# EasyEDA schematic aqicluster_easyeda.json
TITLE: Sheet_1; REV: 1.0; Date: 2021-01-19; Sheet: 1/1; Drawn By: elamdf; Company: Your Company
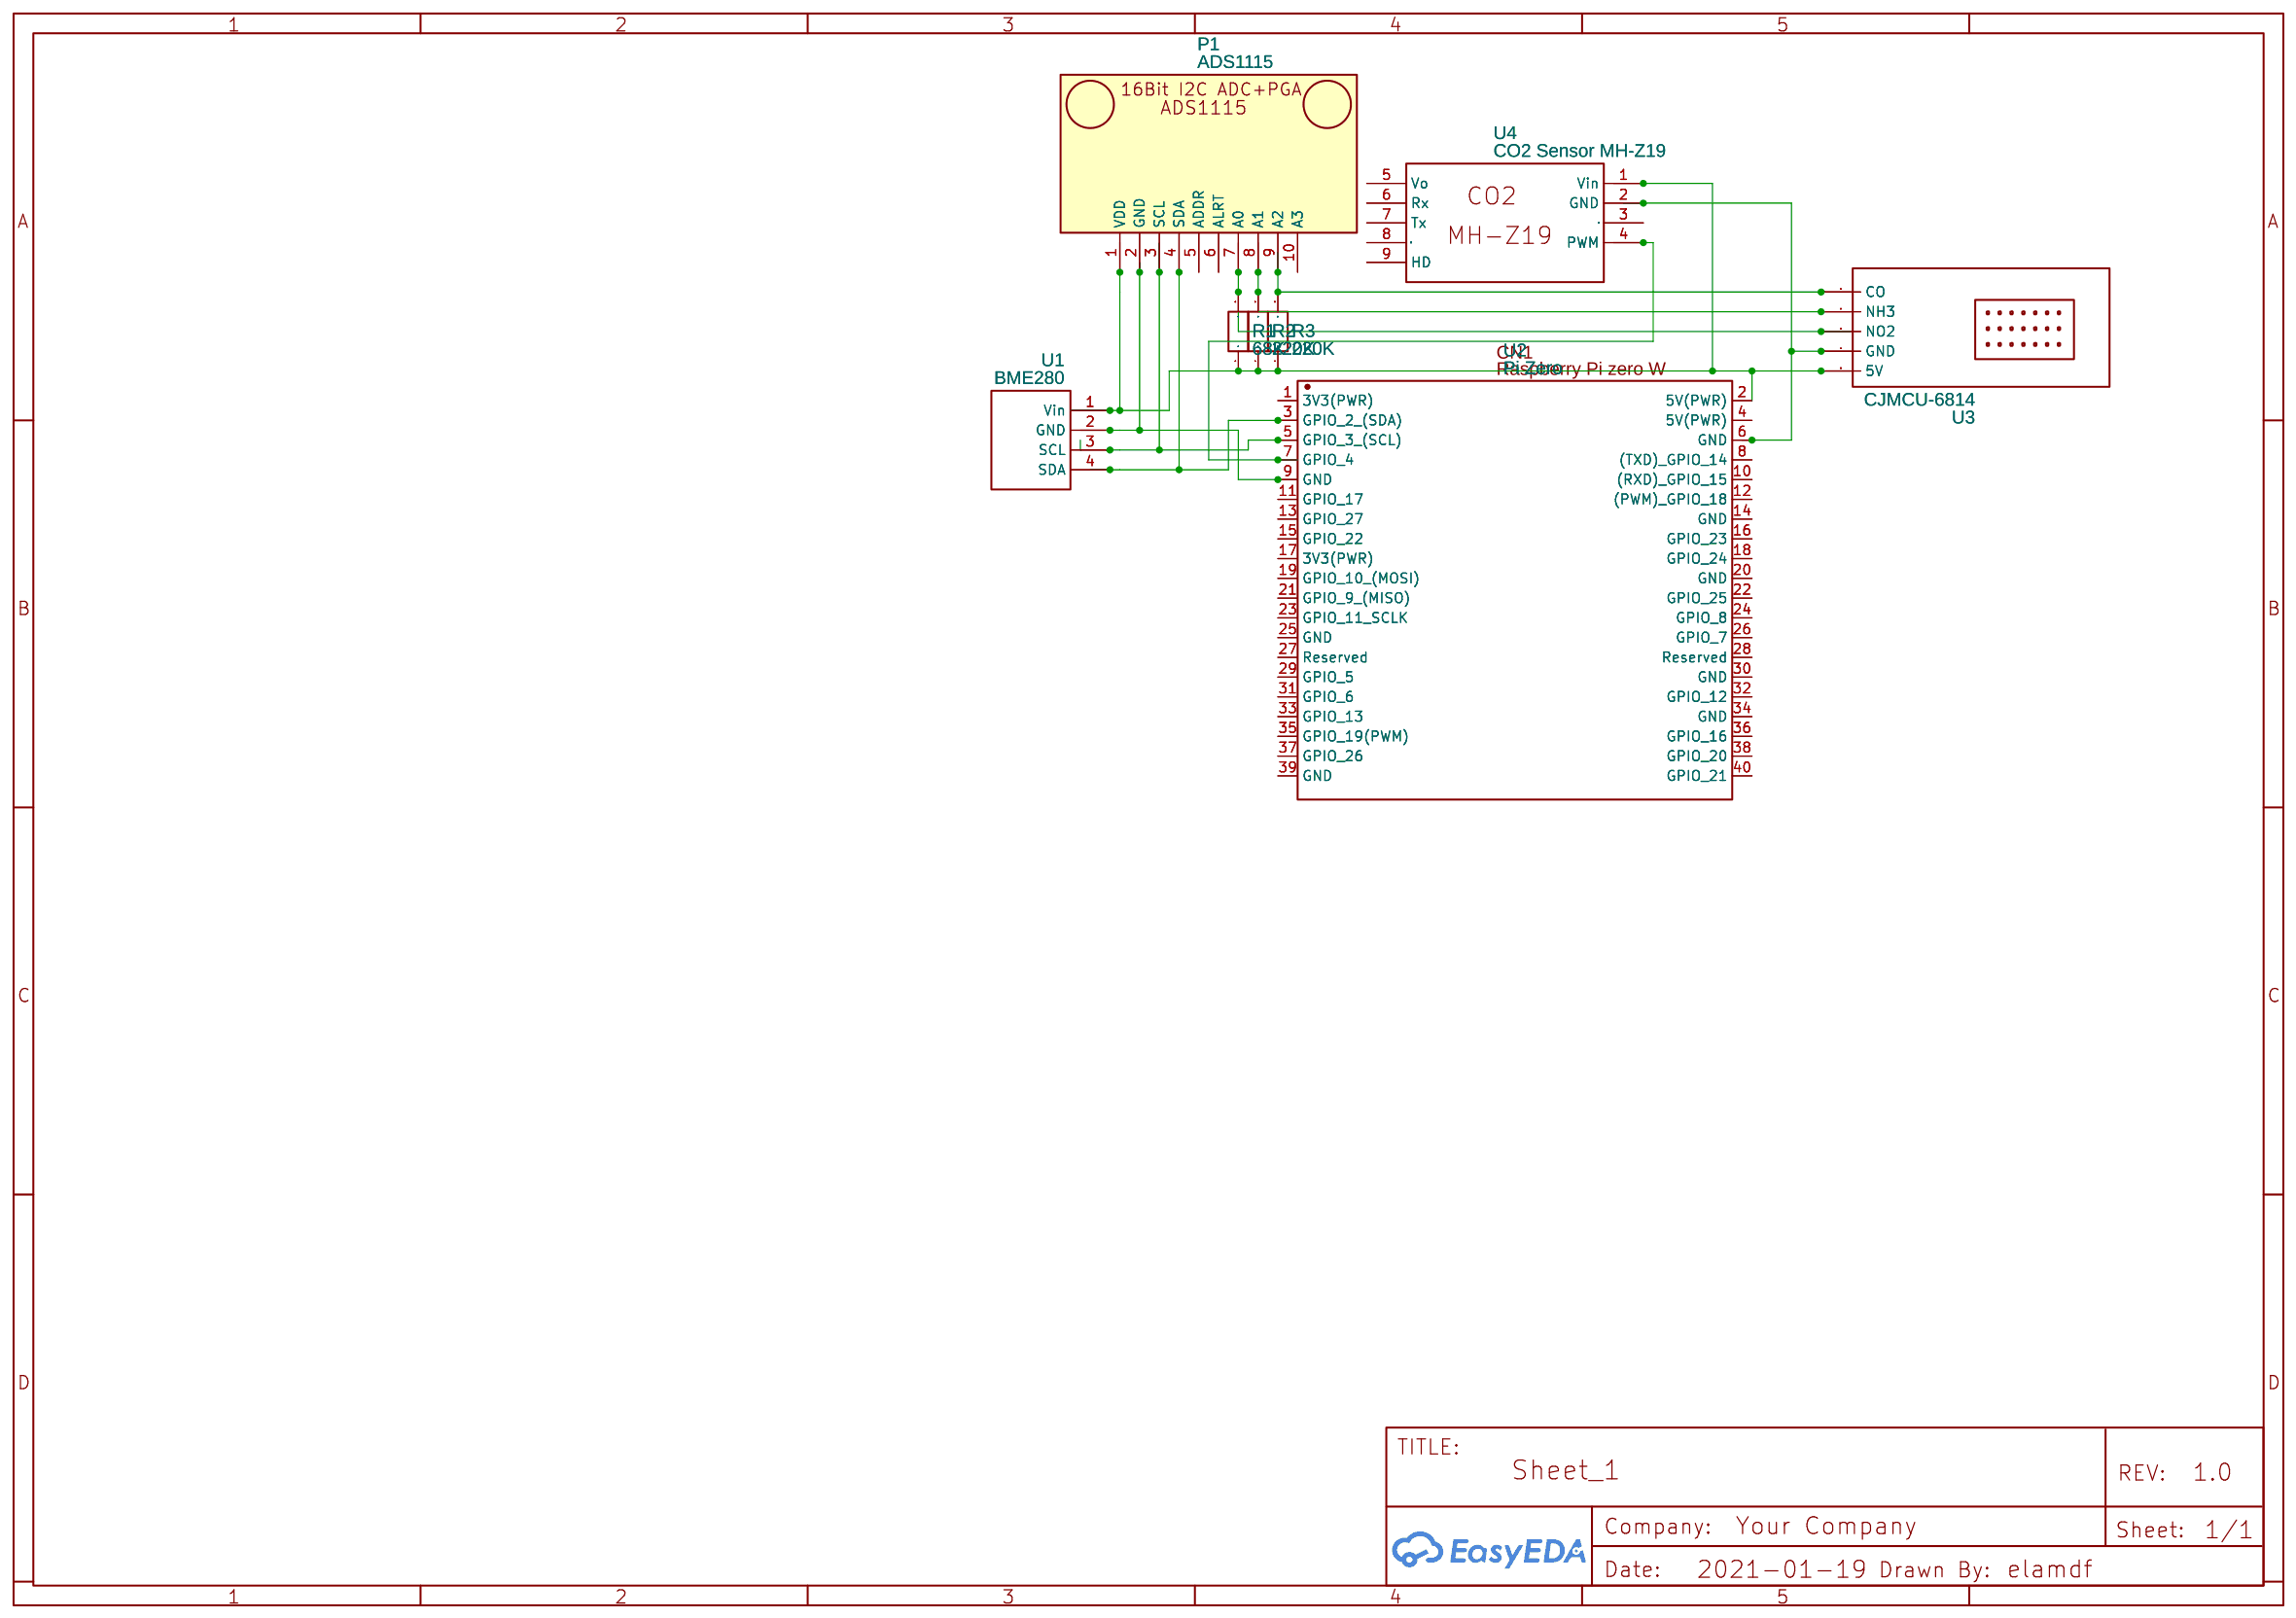
[diagram p0: schematic sheet]

## Parts
P1  ADS1115  [ADS1115 BREAKOUT BOARD NO HOLES]
R1  68K  [1/4 WATT RESISTOR]
R2  220K  [1/4 WATT RESISTOR]
R3  220K  [1/4 WATT RESISTOR]
U1  BME280  [BME280]
U2  Pi Zero  [RASPBERRY_PI_ZERO]
U3  CJMCU-6814  [CJMCUADS1115]
U4  CO2 Sensor MH-Z19  [CO2 SENSOR MH-Z19]

## Library data of the parts
P1 = ADS1115: sourceId: 1T5FDZYC8
R1 = 68K: Contributor: canarywood
R2 R3 = 220K: Contributor: canarywood
U1 = BME280: Contributor: Kuba Jaszczur
U2 = Pi Zero: Contributor: James Stallings
U3 = CJMCU-6814: Manufacturer Part: CJMCU; Contributor: kacperpaciorkowski123; Supplier Part: https://pt.aliexpress.com/item/32762216430.html; Supplier: banggood
U4 = CO2 Sensor MH-Z19: Contributor: allvex

## Nets
Net-(P1-1): P1.1(VDD) R1.1 R2.1 R3.1 U1.1(Vin) U2.2(5V(PWR)) U3.5(5V) U4.1(Vin)
Net-(P1-2): P1.2(GND) U1.2(GND) U2.9(GND)
Net-(P1-3): P1.3(SCL) U1.3(SCL) U2.5(GPIO 3 (SCL))
Net-(P1-4): P1.4(SDA) U1.4(SDA) U2.3(GPIO 2 (SDA))
Net-(P1-7): P1.7(A0) R1.2 U3.3(NO2)
Net-(P1-8): P1.8(A1) R2.2 U3.2(NH3)
Net-(P1-9): P1.9(A2) R3.2 U3.1(CO)
Net-(U2-6): U2.6(GND) U3.4(GND) U4.2(GND)
Net-(U2-7): U2.7(GPIO 4) U4.4(PWM)

Not connected (* = marked no-connect by the designer): P1 5(ADDR) 6(ALRT) 10(A3); U2 1(3V3(PWR)) 4(5V(PWR)) 8((TXD) GPIO 14) 10((RXD) GPIO 15) 11(GPIO 17) 12((PWM) GPIO 18) 13(GPIO 27) 14(GND) 15(GPIO 22) 16(GPIO 23) 17(3V3(PWR)) 18(GPIO 24) 19(GPIO 10 (MOSI)) 20(GND) 21(GPIO 9 (MISO)) 22(GPIO 25) 23(GPIO 11 SCLK) 24(GPIO 8) 25(GND) 26(GPIO 7) 27(Reserved) 28(Reserved) 29(GPIO 5) 30(GND) 31(GPIO 6) 32(GPIO 12) 33(GPIO 13) 34(GND) 35(GPIO 19(PWM)) 36(GPIO 16) 37(GPIO 26) 38(GPIO 20) 39(GND) 40(GPIO 21); U4 3 5(Vo) 6(Rx) 7(Tx) 8 9(HD)
